# Altium schematic sheet Voltage_Regulator.SchDoc
size A; SheetNumber: 4; SheetTotal: 5
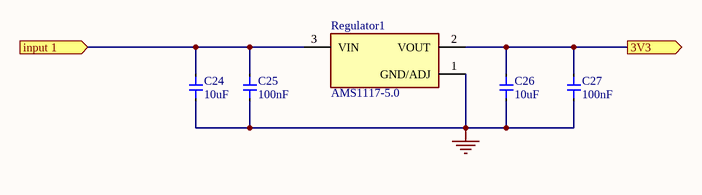
[diagram p0: Voltage_Regulator.SchDoc]

## Parts
C24  10uF  [Cap 0805]
C25  100nF  [Cap 0805]
C26  10uF  [Cap 0805]
C27  100nF  [Cap 0805]
Regulator1  AMS1117-5.0  [SOT229P700X180-4N]

## Ports
3V3 (out), input 1 (in)

## Nets
GND: C24.2 C25.2 C26.2 C27.2 Regulator1.1(GND/ADJ)
3V3: C26.1 C27.1 Regulator1.2(VOUT) ; port 3V3
input 1: C24.1 C25.1 Regulator1.3(VIN) ; port input 1

## Library data of the parts
C24-C27 = Cap 0805: Capacitor SMD 0805
Regulator1 = AMS1117-5.0: 1A LOW DROPOUT VOLTAGE REGULATOR; MF: ams; MP: AMS1117-5.0; Package: SOT-223 Seeed Technology; SnapEDA_Link: https://www.snapeda.com/parts/AMS1117-5.0/ams/view-part/?ref=snap; Check_prices: https://www.snapeda.com/parts/AMS1117-5.0/ams/view-part/?ref=eda; Availability: Not in stock; Value: *; Price: None